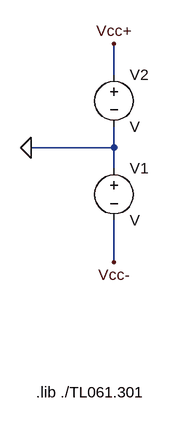
[diagram p0: schematic Draft1.asc]
Draft1.asc, the LTspice schematic file:
Version 4
SHEET 1 880 680
WIRE 128 -16 128 -64
WIRE 128 96 128 64
WIRE 128 96 0 96
WIRE 128 128 128 96
WIRE 128 272 128 208
FLAG 0 96 0
FLAG 128 -64 Vcc+
FLAG 128 272 Vcc-
SYMBOL voltage 128 112 R0
SYMATTR InstName V1
SYMBOL voltage 128 -32 R0
SYMATTR InstName V2
TEXT 8 472 Left 2 !.lib ./TL061.301

The netlist it stands for:
* Draft1.asc
V1 0 Vcc- V
V2 Vcc+ 0 V
.lib ./TL061.301
.backanno
.end